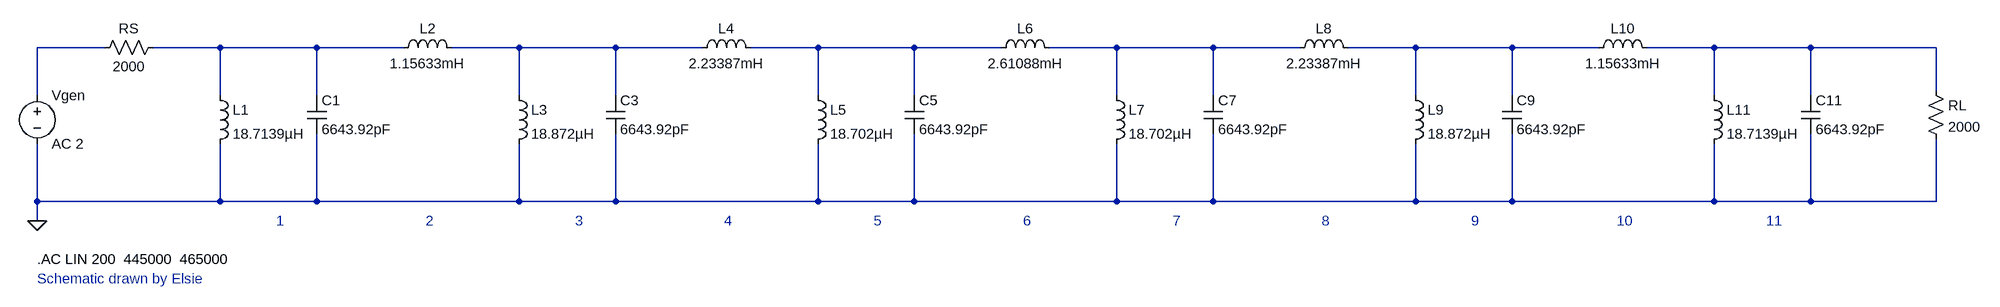
[diagram p0: schematic MurataCFWS455HT.asc]
MurataCFWS455HT.asc, the LTspice schematic file:
Version 4
SHEET 1 3236 600
WIRE 112 80 0 80
WIRE 304 80 192 80
WIRE 464 80 304 80
WIRE 608 80 464 80
WIRE 800 80 688 80
WIRE 960 80 800 80
WIRE 1104 80 960 80
WIRE 1296 80 1184 80
WIRE 1456 80 1296 80
WIRE 1600 80 1456 80
WIRE 1792 80 1680 80
WIRE 1952 80 1792 80
WIRE 2096 80 1952 80
WIRE 2288 80 2176 80
WIRE 2448 80 2288 80
WIRE 2592 80 2448 80
WIRE 2784 80 2672 80
WIRE 2944 80 2784 80
WIRE 3152 80 2944 80
WIRE 3152 152 3152 80
WIRE 0 160 0 80
WIRE 304 160 304 80
WIRE 464 160 464 80
WIRE 800 160 800 80
WIRE 960 160 960 80
WIRE 1296 160 1296 80
WIRE 1456 160 1456 80
WIRE 1792 160 1792 80
WIRE 1952 160 1952 80
WIRE 2288 160 2288 80
WIRE 2448 160 2448 80
WIRE 2784 160 2784 80
WIRE 2944 160 2944 80
WIRE 0 336 0 240
WIRE 304 336 304 240
WIRE 304 336 0 336
WIRE 464 336 464 224
WIRE 464 336 304 336
WIRE 800 336 800 240
WIRE 800 336 464 336
WIRE 960 336 960 224
WIRE 960 336 800 336
WIRE 1296 336 1296 240
WIRE 1296 336 960 336
WIRE 1456 336 1456 224
WIRE 1456 336 1296 336
WIRE 1792 336 1792 240
WIRE 1792 336 1456 336
WIRE 1952 336 1952 224
WIRE 1952 336 1792 336
WIRE 2288 336 2288 240
WIRE 2288 336 1952 336
WIRE 2448 336 2448 224
WIRE 2448 336 2288 336
WIRE 2784 336 2784 240
WIRE 2784 336 2448 336
WIRE 2944 336 2944 224
WIRE 2944 336 2784 336
WIRE 3152 336 3152 232
WIRE 3152 336 2944 336
WIRE 0 368 0 336
FLAG 0 368 0
SYMBOL voltage 0 144 R0
WINDOW 123 24 132 Left 0
SYMATTR InstName Vgen
SYMATTR Value AC 2
SYMBOL res 208 64 R90
WINDOW 0 0 56 VBottom 0
WINDOW 3 32 56 VTop 0
SYMATTR InstName RS
SYMATTR Value 2000
SYMBOL ind 288 144 R0
SYMATTR InstName L1
SYMATTR Value 18.7139µH
SYMATTR SpiceLine Rser=0.1215916
SYMBOL cap 448 160 R0
SYMATTR InstName C1
SYMATTR Value 6643.92pF
SYMBOL ind 592 96 R270
WINDOW 0 32 56 VTop 0
WINDOW 3 5 56 VBottom 0
SYMATTR InstName L2
SYMATTR Value 1.15633mH
SYMATTR SpiceLine Rser=7.513144
SYMBOL ind 784 144 R0
SYMATTR InstName L3
SYMATTR Value 18.872µH
SYMATTR SpiceLine Rser=0.1226189
SYMBOL cap 944 160 R0
SYMATTR InstName C3
SYMATTR Value 6643.92pF
SYMBOL ind 1088 96 R270
WINDOW 0 32 56 VTop 0
WINDOW 3 5 56 VBottom 0
SYMATTR InstName L4
SYMATTR Value 2.23387mH
SYMATTR SpiceLine Rser=14.51428
SYMBOL ind 1280 144 R0
SYMATTR InstName L5
SYMATTR Value 18.702µH
SYMATTR SpiceLine Rser=0.121514
SYMBOL cap 1440 160 R0
SYMATTR InstName C5
SYMATTR Value 6643.92pF
SYMBOL ind 1584 96 R270
WINDOW 0 32 56 VTop 0
WINDOW 3 5 56 VBottom 0
SYMATTR InstName L6
SYMATTR Value 2.61088mH
SYMATTR SpiceLine Rser=16.96387
SYMBOL ind 1776 144 R0
SYMATTR InstName L7
SYMATTR Value 18.702µH
SYMATTR SpiceLine Rser=0.121514
SYMBOL cap 1936 160 R0
SYMATTR InstName C7
SYMATTR Value 6643.92pF
SYMBOL ind 2080 96 R270
WINDOW 0 32 56 VTop 0
WINDOW 3 5 56 VBottom 0
SYMATTR InstName L8
SYMATTR Value 2.23387mH
SYMATTR SpiceLine Rser=14.51428
SYMBOL ind 2272 144 R0
SYMATTR InstName L9
SYMATTR Value 18.872µH
SYMATTR SpiceLine Rser=0.1226189
SYMBOL cap 2432 160 R0
SYMATTR InstName C9
SYMATTR Value 6643.92pF
SYMBOL ind 2576 96 R270
WINDOW 0 32 56 VTop 0
WINDOW 3 5 56 VBottom 0
SYMATTR InstName L10
SYMATTR Value 1.15633mH
SYMATTR SpiceLine Rser=7.513144
SYMBOL ind 2768 144 R0
SYMATTR InstName L11
SYMATTR Value 18.7139µH
SYMATTR SpiceLine Rser=0.1215916
SYMBOL cap 2928 160 R0
SYMATTR InstName C11
SYMATTR Value 6643.92pF
SYMBOL res 3136 136 R0
SYMATTR InstName RL
SYMATTR Value 2000
TEXT 0 432 Left 0 !.AC LIN 200  445000  465000
TEXT 0 464 Left 0 ;Schematic drawn by Elsie
TEXT 400 368 Center 0 ; 1
TEXT 648 368 Center 0 ; 2
TEXT 896 368 Center 0 ; 3
TEXT 1144 368 Center 0 ; 4
TEXT 1392 368 Center 0 ; 5
TEXT 1640 368 Center 0 ; 6
TEXT 1888 368 Center 0 ; 7
TEXT 2136 368 Center 0 ; 8
TEXT 2384 368 Center 0 ; 9
TEXT 2632 368 Center 0 ; 10
TEXT 2880 368 Center 0 ; 11

The netlist it stands for:
* MurataCFWS455HT.asc
Vgen N001 0 AC 2
RS N002 N001 2000
L1 N002 0 18.7139µH Rser=0.1215916
C1 N002 0 6643.92pF
L2 N002 N003 1.15633mH Rser=7.513144
L3 N003 0 18.872µH Rser=0.1226189
C3 N003 0 6643.92pF
L4 N003 N004 2.23387mH Rser=14.51428
L5 N004 0 18.702µH Rser=0.121514
C5 N004 0 6643.92pF
L6 N004 N005 2.61088mH Rser=16.96387
L7 N005 0 18.702µH Rser=0.121514
C7 N005 0 6643.92pF
L8 N005 N006 2.23387mH Rser=14.51428
L9 N006 0 18.872µH Rser=0.1226189
C9 N006 0 6643.92pF
L10 N006 N007 1.15633mH Rser=7.513144
L11 N007 0 18.7139µH Rser=0.1215916
C11 N007 0 6643.92pF
RL N007 0 2000
.AC LIN 200  445000  465000
* Schematic drawn by Elsie
*  1
*  2
*  3
*  4
*  5
*  6
*  7
*  8
*  9
*  10
*  11
.backanno
.end